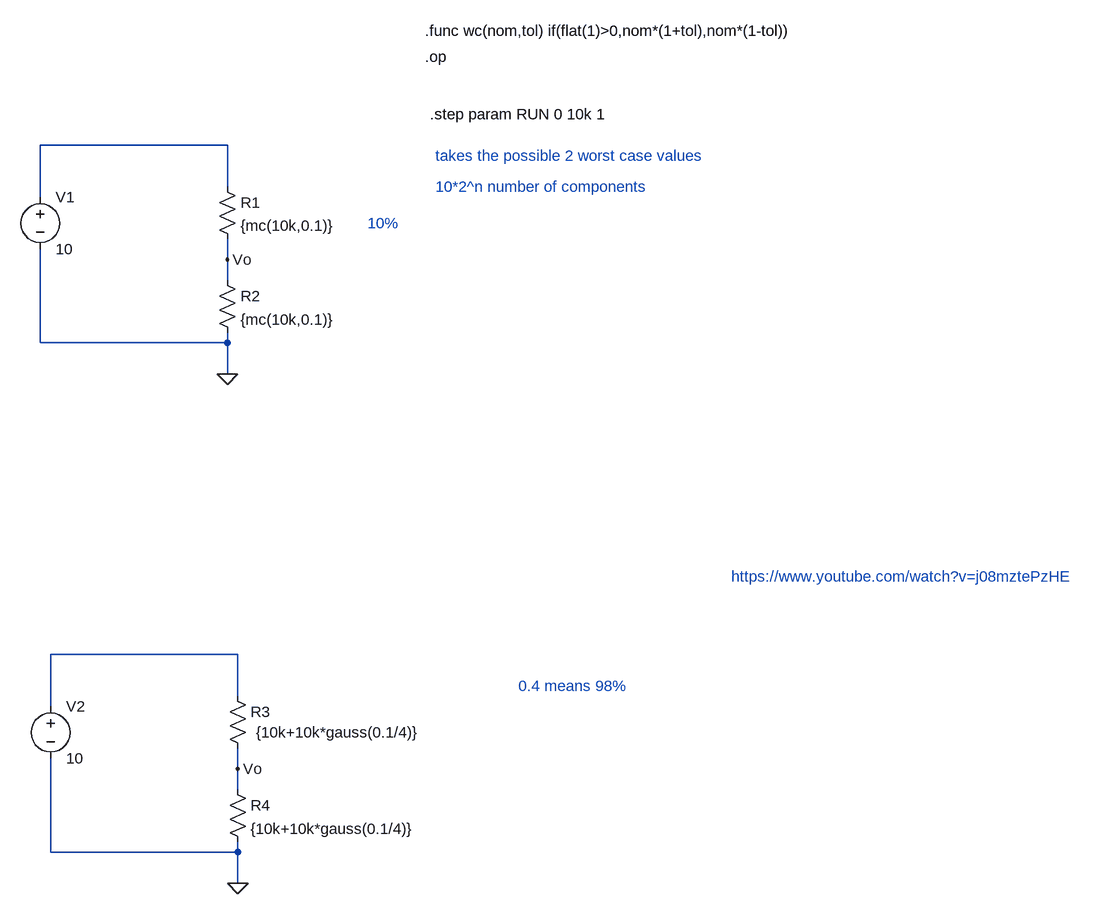
[diagram p0: schematic MONTE CARLO.asc]
MONTE CARLO.asc, the LTspice schematic file:
Version 4.1
SHEET 1 3052 1188
WIRE 96 32 -192 32
WIRE 96 96 96 32
WIRE -192 112 -192 32
WIRE 96 208 96 176
WIRE 96 240 96 208
WIRE -192 336 -192 192
WIRE 96 336 96 320
WIRE 96 336 -192 336
WIRE 96 384 96 336
WIRE 112 816 -176 816
WIRE 112 880 112 816
WIRE -176 896 -176 816
WIRE 112 992 112 960
WIRE 112 1024 112 992
WIRE -176 1120 -176 976
WIRE 112 1120 112 1104
WIRE 112 1120 -176 1120
WIRE 112 1168 112 1120
FLAG 96 384 0
FLAG 96 208 Vo
FLAG 112 1168 0
FLAG 112 992 Vo
SYMBOL res 80 80 R0
SYMATTR InstName R1
SYMATTR Value {mc(10k,0.1)}
SYMBOL res 80 224 R0
SYMATTR InstName R2
SYMATTR Value {mc(10k,0.1)}
SYMBOL voltage -192 96 R0
WINDOW 123 0 0 Left 0
WINDOW 39 0 0 Left 0
SYMATTR InstName V1
SYMATTR Value 10
SYMBOL res 96 864 R0
WINDOW 3 44 72 Left 2
SYMATTR InstName R3
SYMATTR Value {10k+10k*gauss(0.1/4)}
SYMBOL res 96 1008 R0
SYMATTR InstName R4
SYMATTR Value {10k+10k*gauss(0.1/4)}
SYMBOL voltage -176 880 R0
WINDOW 123 0 0 Left 0
WINDOW 39 0 0 Left 0
SYMATTR InstName V2
SYMATTR Value 10
TEXT 400 -144 Left 2 !.func wc(nom,tol) if(flat(1)>0,nom*(1+tol),nom*(1-tol))
TEXT 400 -104 Left 2 !.op
TEXT 312 152 Left 2 ;10%
TEXT 416 48 Left 2 ;takes the possible 2 worst case values
TEXT 416 96 Left 2 ;10*2^n number of components
TEXT 408 -16 Left 2 !.step param RUN 0 10k 1
TEXT 544 864 Left 2 ;0.4 means 98%
TEXT 872 696 Left 2 ;https://www.youtube.com/watch?v=j08mztePzHE

The netlist it stands for:
* MONTE CARLO.asc
R1 N001 Vo {mc(10k,0.1)}
R2 Vo 0 {mc(10k,0.1)}
V1 N001 0 10
R3 N002 Vo {10k+10k*gauss(0.1/4)}
R4 Vo 0 {10k+10k*gauss(0.1/4)}
V2 N002 0 10
.func wc(nom,tol) if(flat(1)>0,nom*(1+tol),nom*(1-tol))
.op
* 10%
* takes the possible 2 worst case values
* 10*2^n number of components
.step param RUN 0 10k 1
* 0.4 means 98%
* https://www.youtube.com/watch?v=j08mztePzHE
.backanno
.end